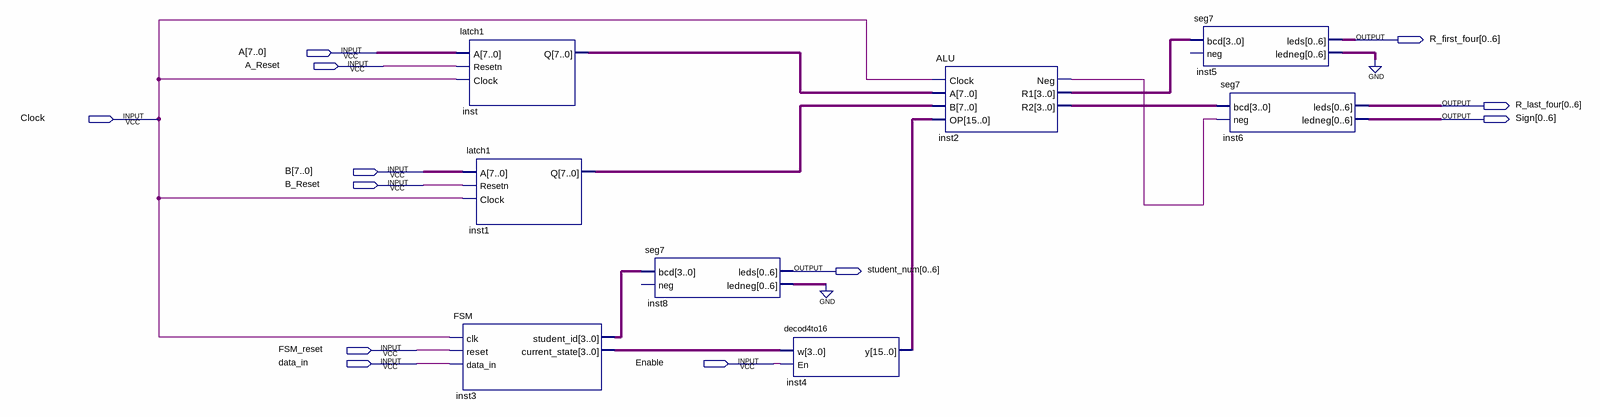
[diagram p0: schematic sheet]
// Quartus schematic GPU.bdf as structural Verilog: 8 symbols, 12 pins
module GPU (
  input  [7:0] A,
  input  A_Reset,
  input  Clock,
  input  [7:0] B,
  input  B_Reset,
  input  FSM_reset,
  input  data_in,
  input  Enable,
  output [0:6] R_first_four,
  output [0:6] R_last_four,
  output [0:6] Sign,
  output [0:6] student_num
);

  wire inst2_neg;
  wire [3:0] inst2_r1, inst2_r2, inst3_current_state, inst3_student_id;
  wire [6:0] inst5_ledneg, inst8_ledneg;
  wire [7:0] inst1_q, inst_q;
  wire [15:0] inst4_y;

  latch1 inst (.A(A), .Resetn(A_Reset), .Clock(Clock), .Q(inst_q));
  latch1 inst1 (.A(B), .Resetn(B_Reset), .Clock(Clock), .Q(inst1_q));
  FSM inst3 (
    .clk(Clock), .reset(FSM_reset), .data_in(data_in), .student_id(inst3_student_id),
    .current_state(inst3_current_state));
  seg7 inst8 (.bcd(inst3_student_id), .leds(student_num), .ledneg(inst8_ledneg));  // open: neg
  decod4to16 inst4 (.w(inst3_current_state), .En(Enable), .y(inst4_y));
  ALU inst2 (.Clock(Clock), .A(inst_q), .B(inst1_q), .OP(inst4_y), .Neg(inst2_neg), .R1(inst2_r1), .R2(inst2_r2));
  seg7 inst5 (.bcd(inst2_r1), .leds(R_first_four), .ledneg(inst5_ledneg));  // open: neg
  seg7 inst6 (.bcd(inst2_r2), .neg(inst2_neg), .leds(R_last_four), .ledneg(Sign));
  // also tied to GND on the sheet: {inst5_ledneg[0], inst5_ledneg[1], inst5_ledneg[2], inst5_ledneg[3], inst5_ledneg[4], inst5_ledneg[5], inst5_ledneg[6], inst8_ledneg[0], inst8_ledneg[1], inst8_ledneg[2], inst8_ledneg[3], inst8_ledneg[4], inst8_ledneg[5], inst8_ledneg[6]}
endmodule
